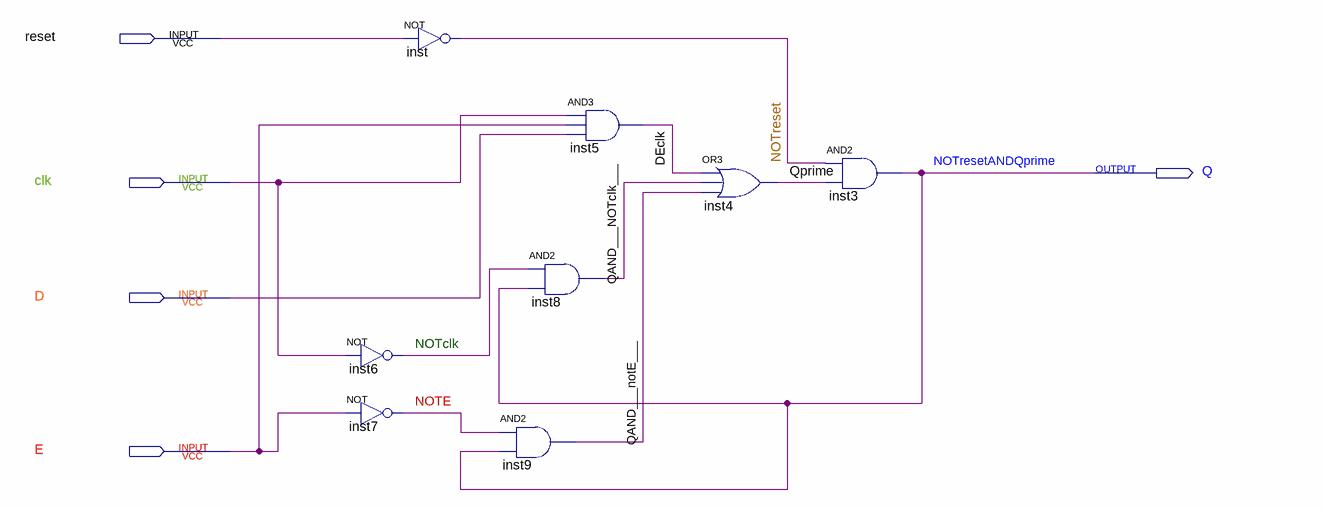
[diagram p0: schematic sheet]
// Quartus schematic DESwitch.bdf as structural Verilog: 8 symbols, 5 pins
module DESwitch (
  input  reset,
  input  clk,
  input  D,
  input  E,
  output Q
);

  wire DEclk, NOTclk, NOTE, NOTreset, QAND___NOTclk___, QAND___notE___, Qprime;

  not inst (NOTreset, reset);
  not inst6 (NOTclk, clk);
  not inst7 (NOTE, E);
  and inst8 (QAND___NOTclk___, NOTclk, Q);
  and inst9 (QAND___notE___, NOTE, Q);
  and inst5 (DEclk, clk, E, D);
  or inst4 (Qprime, DEclk, QAND___NOTclk___, QAND___notE___);
  and inst3 (Q, NOTreset, Qprime);

  // Other names for the same wires on the sheet: NOTresetANDQprime = Q
endmodule
